# Altium schematic sheet PERIPHERALS.SchDoc
size A4
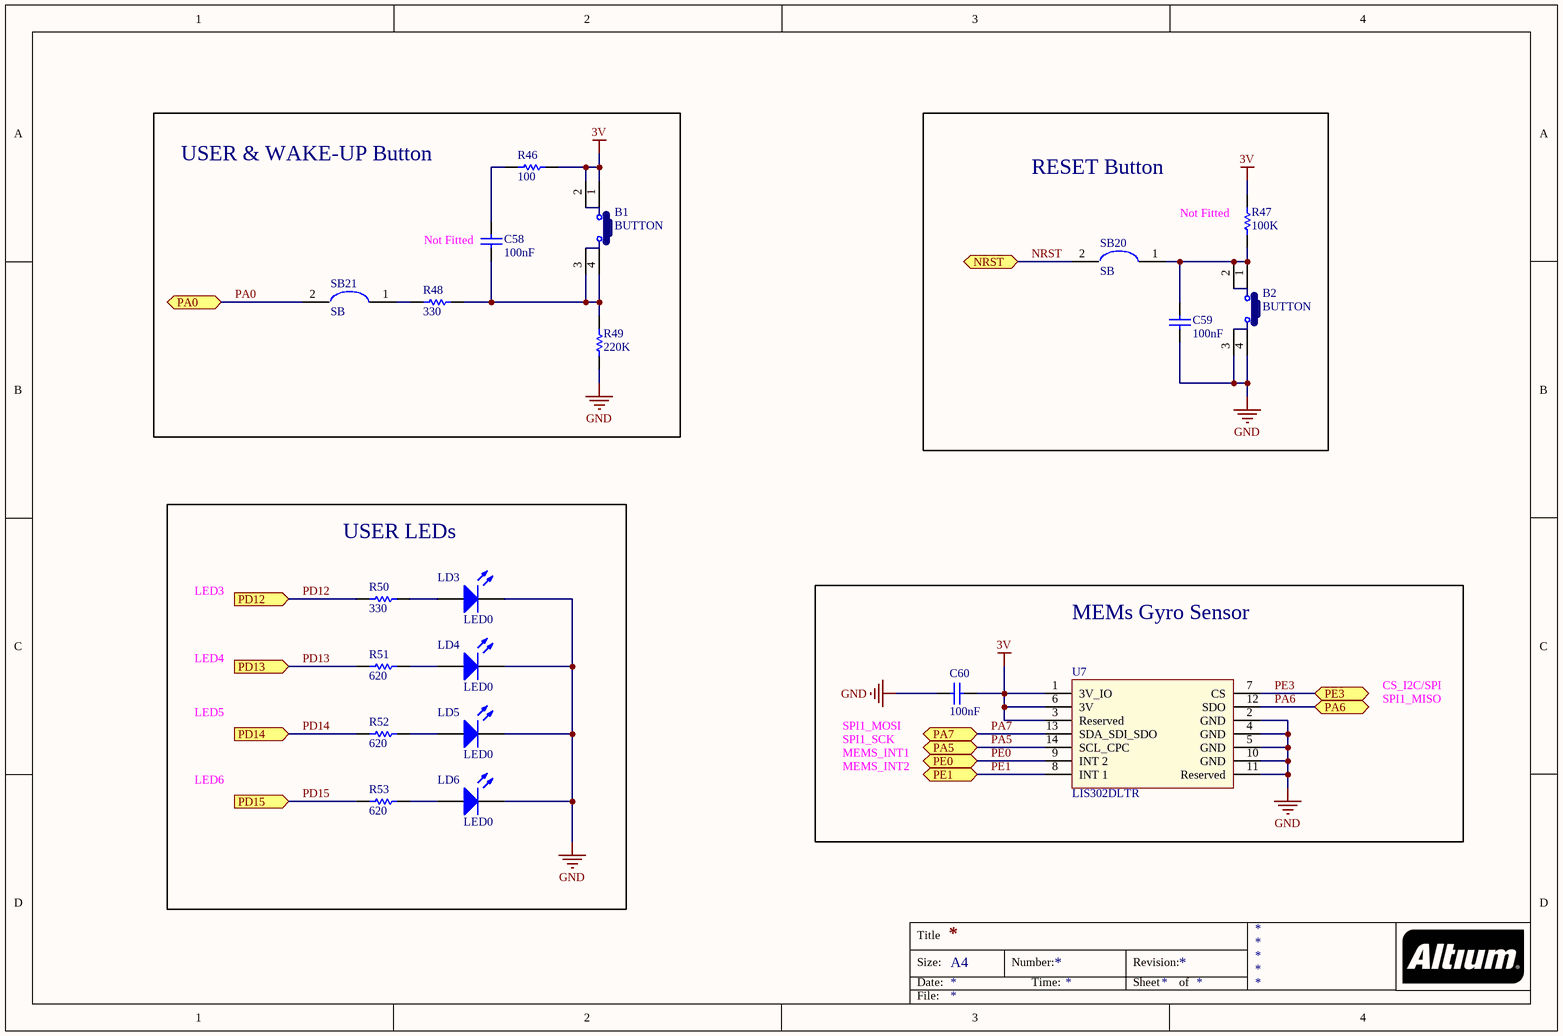
[diagram p0: PERIPHERALS.SchDoc]

## Parts
B1  BUTTON  [TL3301PF160QG]
B2  BUTTON  [TL3301PF160QG]
C58  value 100nF  [CAPC0603B]  (hidden comment: Cap)
C59  value 100nF  [CAPC0603B]  (hidden comment: Cap)
C60  value 100nF  [CAPC0603B]  (hidden comment: Cap)
LD3  LED0  [LED_0603]
LD4  LED0  [LED_0603]
LD5  LED0  [LED_0603]
LD6  LED0  [LED_0603]
R46  value 100  [RESC0402B]  (hidden comment: Res1)
R47  value 100K  [RESC0402B]  (hidden comment: Res1)
R48  value 330  [RESC0402B]  (hidden comment: Res1)
R49  value 220K  [RESC0603B]  (hidden comment: Res1)
R50  value 330  [RESC0402B]  (hidden comment: Res1)
R51  value 620  [RESC0402B]  (hidden comment: Res1)
R52  value 620  [RESC0402B]  (hidden comment: Res1)
R53  value 620  [RESC0402B]  (hidden comment: Res1)
SB20  SB  [SB]
SB21  SB  [SB]
U7  LIS302DLTR  [LIS302DLTR]

## Blocks framed on the sheet
USER & WAKE-UP Button: B1 C58 R46 R48 R49 SB21
RESET Button: B2 C59 R47 SB20
USER LEDs: LD3-LD6 R50-R53
MEMs Gyro Sensor: C60 U7

## Ports
NRST (bidir), PA0 (bidir), PA5 (bidir), PA6 (bidir), PA7 (bidir), PD12 (in), PD13 (in), PD14 (in), PD15 (in), PE0 (bidir), PE1 (bidir), PE3 (bidir)

## Nets
3V: B1.1 B1.2 C60.2 R46.1 R47.1 U7.1(3V_IO) U7.3(Reserved) U7.6(3V)
GND: B2.3 B2.4 C59.2 C60.1 LD3.2(K) LD4.2(K) LD5.2(K) LD6.2(K) R49.1 U7.2(GND) U7.4(GND) U7.5(GND) U7.10(GND) U7.11(Reserved)
NRST: SB20.2 ; port NRST
PA0: SB21.2 ; port PA0
PA5: U7.14(SCL_CPC) ; port PA5
PA6: U7.12(SDO) ; port PA6
PA7: U7.13(SDA_SDI_SDO) ; port PA7
PD12: R50.1 ; port PD12
PD13: R51.1 ; port PD13
PD14: R52.1 ; port PD14
PD15: R53.1 ; port PD15
PE0: U7.9(INT_2) ; port PE0
PE1: U7.8(INT_1) ; port PE1
PE3: U7.7(CS) ; port PE3
NetB1_3: B1.3 B1.4 C58.1 R48.2 R49.2
NetB2_1: B2.1 B2.2 C59.1 R47.2 SB20.1
NetC58_2: C58.2 R46.2
NetLD3_1: LD3.1(A) R50.2
NetLD4_1: LD4.1(A) R51.2
NetLD5_1: LD5.1(A) R52.2
NetLD6_1: LD6.1(A) R53.2
NetR48_1: R48.1 SB21.1

## Notes on the sheet
- (near C58) Not Fitted
- (near R47) Not Fitted
- LED3
- LED4
- LED5
- CS_I2C/SPI
- SPI1_MISO
- LED6
- SPI1_MOSI
- SPI1_SCK
- MEMS_INT1
- MEMS_INT2
- Title
- Size:
- Date:
- A4
- Number:
- Time:
- Revision:
- Sheet
- of
- File:

## Library data of the parts
B1 B2 = BUTTON: Manufacturer: TE Connectivity (Tyco Electronics); Manufacturer Part Number: 4-1437565-9; Actuator Length: 3.4 mm; Body Orientation: Straight; Actuator Style: Round Button; Electrical Life: 100000 Cycle; Dielectric Strength: 500 VAC; Contact Rating @ Voltage: 0.05@12VDC A; Maximum DC Voltage Rating: 12 V; Illumination Type: N/R; Maximum Contact Resistance: 100 mOhm; Operating Force: 1.57 N; Actuation Force: 1.6 N; Supplier 1: RSComponents; Stock 1: 850; Actuator Color: N/A; Contact Material: Copper Alloy; Base Material: N/A; Family: FSMJSMA; Contact Plating: Silver; Ground Terminal: N/A; Housing Material: N/A; Dimension: 6 x 10 x 7.25 mm; Part No: 4-1437565-9; RoHS: Yes; Maximum AC Voltage Rating: N/A; Seal Description: N/A; Pole Throw Configuration: N/A; Mechanical Life: N/A; Packaging: Bulk; Product Weight: N/A; Mounting: Surface Mount,Gull Wing; Minimum Insulation Resistance: 100 MOhm; Operating Temperature: -20 to 85 C; Type: N/A; Switch Configuration: N/A; Seal Location: N/A; ComponentLink1URL: https://datasheet.ciiva.com/8164/eng-cs-1308111-1-switches-core-program-catalog-0308-8164805.pdf; ComponentLink1Description: https://datasheet.ciiva.com/8164/eng-cs-1308111-1-switches-core-program-catalog-0308-8164805.pdf; ComponentLink2URL: https://datasheet.ciiva.com/8082/eng-cs-1308111-1-switches-core-program-catalog-0308-8082679.pdf; ComponentLink2Description: https://datasheet.ciiva.com/8082/eng-cs-1308111-1-switches-core-program-catalog-0308-8082679.pdf; ComponentLink3URL: https://datasheet.ciiva.com/16535/eng-cs-1308111-1-switches-core-program-catalog-0308-16535272.pdf; ComponentLink3Description: https://datasheet.ciiva.com/16535/eng-cs-1308111-1-switches-core-program-catalog-0308-16535272.pdf; Supplier 2: Mouser; Stock 2: 6488; Pricing 2: 1=0.39, 10=0.381, 50=0.354, 100=0.34, 1000=0.272, 10000=0.204 (USD); Size: 6 x 6 mm; Termination Style: Gull Wing; ComponentLink4URL: https://datasheet.ciiva.com/16156/p010593-16156341.pdf; ComponentLink4Description: https://datasheet.ciiva.com/16156/p010593-16156341.pdf; ComponentLink5URL: https://datasheet.ciiva.com/2900/tl3301-2900813.pdf; ComponentLink5Description: https://datasheet.ciiva.com/2900/tl3301-2900813.pdf; ComponentLink6URL: https://datasheet.ciiva.com/2900/tl3301-2900814.pdf; ComponentLink6Description: https://datasheet.ciiva.com/2900/tl3301-2900814.pdf; ComponentLink7URL: https://datasheet.ciiva.com/2900/tl3301-2900815.pdf; ComponentLink7Description: https://datasheet.ciiva.com/2900/tl3301-2900815.pdf
C58-C60 = Cap_3: Capacitor; Published: 8-Jun-2000; LatestRevisionDate: 17-Jul-2002; LatestRevisionNote: Re-released for DXP Platform.; PackageReference: RAD-0.3; Publisher: Altium Limited; PackageDescription: Radial Cap, Thru-Hole; 2 Leads; 0.3 in Pin Spacing
LD3-LD6 = LED0: Typical INFRARED GaAs LED; Published: 8-Jun-2000; LatestRevisionDate: 08-Jul-2005; LatestRevisionNote: Mech Layer 1 removed.; PackageReference: LED-0; Publisher: Altium Limited; PackageDescription: LED; 2 Leads
R46 = Res1_4: Resistor; Published: 8-Jun-2000; LatestRevisionDate: 17-Jul-2002; LatestRevisionNote: Re-released for DXP Platform.; PackageReference: AXIAL-0.3; Publisher: Altium Limited; PackageDescription: Axial Device, Thru-Hole; 2 Leads; 0.3 in Pin Spacing
R47 = Res1_5: Resistor; Published: 8-Jun-2000; LatestRevisionDate: 17-Jul-2002; LatestRevisionNote: Re-released for DXP Platform.; PackageReference: AXIAL-0.3; Publisher: Altium Limited; PackageDescription: Axial Device, Thru-Hole; 2 Leads; 0.3 in Pin Spacing
R48 R50 = Res1_12: Resistor; Published: 8-Jun-2000; LatestRevisionDate: 17-Jul-2002; LatestRevisionNote: Re-released for DXP Platform.; PackageReference: AXIAL-0.3; Publisher: Altium Limited; PackageDescription: Axial Device, Thru-Hole; 2 Leads; 0.3 in Pin Spacing
R49 = Res1_14: Resistor; Published: 8-Jun-2000; LatestRevisionDate: 17-Jul-2002; LatestRevisionNote: Re-released for DXP Platform.; PackageReference: AXIAL-0.3; Publisher: Altium Limited; PackageDescription: Axial Device, Thru-Hole; 2 Leads; 0.3 in Pin Spacing
R51-R53 = Res1_10: Resistor; Published: 8-Jun-2000; LatestRevisionDate: 17-Jul-2002; LatestRevisionNote: Re-released for DXP Platform.; PackageReference: AXIAL-0.3; Publisher: Altium Limited; PackageDescription: Axial Device, Thru-Hole; 2 Leads; 0.3 in Pin Spacing
U7 = LIS302DLTR: Manufacturer: STMicroelectronics; Other Related Documents: LIS302DL View All Specifications; EDA / CAD Models: Download from Accelerated Designs; Axis: X, Y, Z; Acceleration Range: ±2.3g, 9.2g; Sensitivity: 18mg/digit, 72mg/digit; Voltage - Supply: 2.16 V ~ 3.6 V; Output Type: Digital; Bandwidth: 100Hz ~ 400Hz Selectable; Interface: I²C, SPI; Online Catalog: MEMS "piccolo" LIS302DL, LIS352AR and LIS352AX; For Use With: 497-6342-ND  - BOARD EVALUATION FOR LIS302DL 497-6227-ND  - BOARD ADAPTER 20DIP LIS3LV02DL 497-8204-ND  - BOARD ADAPTER LIS302SG DIL24 497-8373-ND  - BOARD EVAL EXTENSION SN250 497-6226-ND  - BOARD EVAL ACCELEROM LIS3LV02DL 497-6246-ND  - BOARD EVAL ACCELEROM LIS302ALK 497-8203-ND  - BOARD DEMO LIS302SG 497-9047-ND  - BOARD DEMO ACCELEROMETER DIL24; Other Names: 497-5911-2; Supplier 1: Digikey; Manufacturer Part Number: LIS302DLTR; Stock 1: 0; Pricing 1: 1=2.99, 10=2.682, 100=2.1973, 500=1.8705 (USD); Standard Package: 5,000; Category: Sensors, Transducers; Family: Accelerometers; Series: MEMS, piccolo; Packaging: Tape & Reel (TR); Mounting Type: Surface Mount; Package / Case: 14-VFLGA; Supplier Device Package: 14-LGA (3x5); ComponentLink1URL: https://datasheet.ciiva.com/2809/cd00135460-2809829.pdf; ComponentLink1Description: https://datasheet.ciiva.com/2809/cd00135460-2809829.pdf; ComponentLink2URL: https://datasheet.ciiva.com/5296/cd00135460-98938-5296661.pdf; ComponentLink2Description: https://datasheet.ciiva.com/5296/cd00135460-98938-5296661.pdf; ComponentLink3URL: https://datasheet.ciiva.com/2809/cd00135460-2809830.pdf; ComponentLink3Description: https://datasheet.ciiva.com/2809/cd00135460-2809830.pdf; ComponentLink4URL: https://datasheet.ciiva.com/2809/cd00135460-2809831.pdf; ComponentLink4Description: https://datasheet.ciiva.com/2809/cd00135460-2809831.pdf; ComponentLink5URL: https://datasheet.ciiva.com/3271/cd00135460-3271564.pdf; ComponentLink5Description: https://datasheet.ciiva.com/3271/cd00135460-3271564.pdf; ComponentLink6URL: https://datasheet.ciiva.com/26928/lis302dltr-26928596.pdf; ComponentLink6Description: https://datasheet.ciiva.com/26928/lis302dltr-26928596.pdf